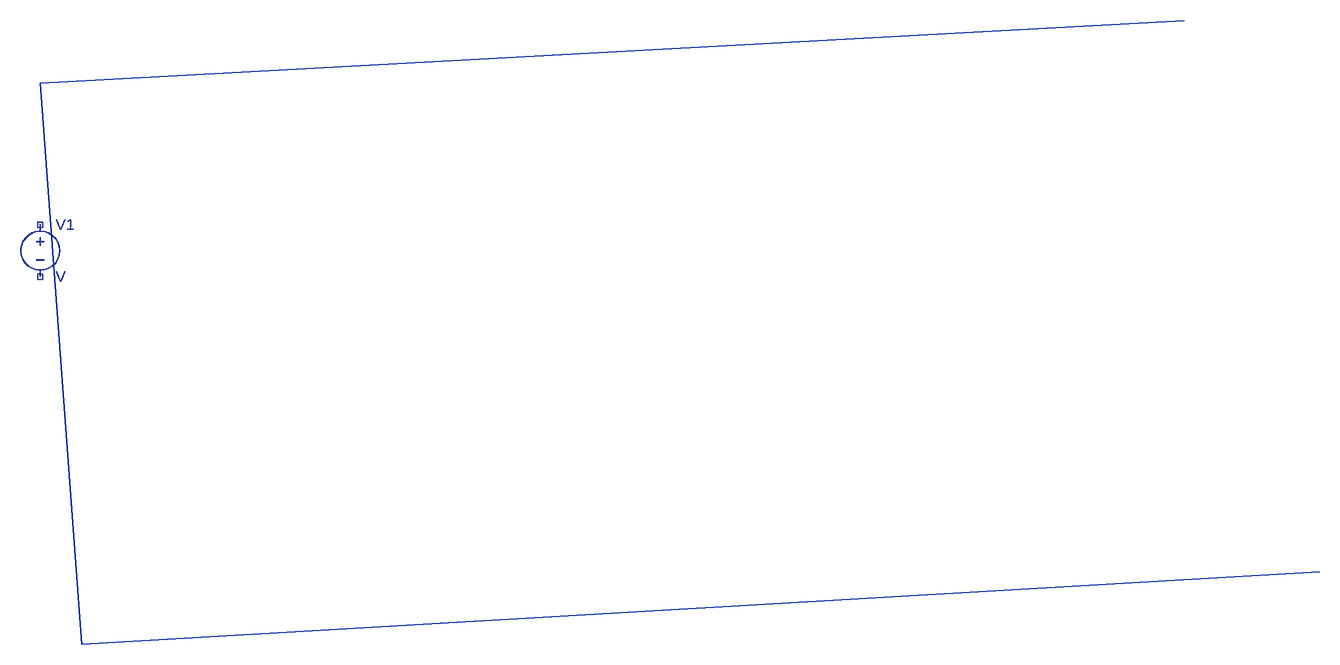
[diagram p0: schematic C10_D1_P2.jpg.asc]
C10_D1_P2.jpg.asc, the LTspice schematic file:
Version 4
SHEET 1 880 680
SYMBOL voltage 1184 1274 R0
SYMATTR InstName V1
WIRE 1248 1936 3152 1824
WIRE 1184 1072 1248 1936
WIRE 1184 1072 2944 976

The netlist it stands for:
* C10_D1_P2.jpg.asc
V1 NC_01 NC_02 V
.backanno
.end